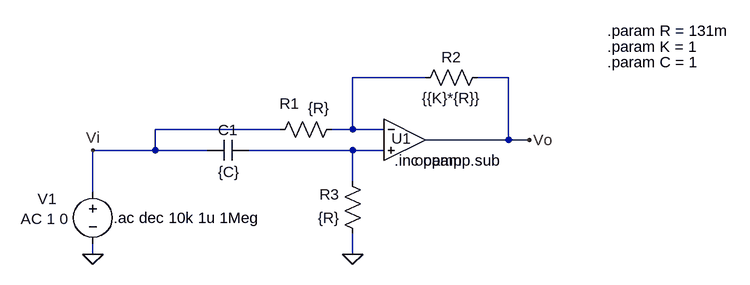
[diagram p0: schematic LatticeActivo.asc]
LatticeActivo.asc, the LTspice schematic file:
Version 4
SHEET 1 880 680
WIRE 288 48 176 48
WIRE 416 48 368 48
WIRE 64 128 -128 128
WIRE 176 128 176 48
WIRE 176 128 144 128
WIRE 224 128 176 128
WIRE 416 144 416 48
WIRE 416 144 288 144
WIRE 448 144 416 144
WIRE -128 160 -128 128
WIRE -128 160 -224 160
WIRE -48 160 -128 160
WIRE 176 160 16 160
WIRE 224 160 176 160
WIRE 176 208 176 160
WIRE -224 224 -224 160
WIRE -224 320 -224 304
WIRE 176 320 176 288
FLAG 176 320 0
FLAG -224 320 0
FLAG 448 144 Vo
FLAG -224 160 Vi
SYMBOL res 160 112 R90
WINDOW 0 -8 81 VBottom 2
WINDOW 3 -33 36 VTop 2
SYMATTR InstName R1
SYMATTR Value {R}
SYMBOL res 384 32 R90
WINDOW 0 0 56 VBottom 2
WINDOW 3 32 56 VTop 2
SYMATTR InstName R2
SYMATTR Value {{K}*{R}}
SYMBOL res 192 304 R180
WINDOW 0 36 76 Left 2
WINDOW 3 36 40 Left 2
SYMATTR InstName R3
SYMATTR Value {R}
SYMBOL cap 16 144 R90
WINDOW 0 0 32 VBottom 2
WINDOW 3 34 30 VTop 2
SYMATTR InstName C1
SYMATTR Value {C}
SYMBOL voltage -224 208 R0
WINDOW 0 -85 27 Left 2
WINDOW 123 -111 58 Left 2
WINDOW 39 0 0 Left 0
SYMATTR InstName V1
SYMATTR Value ""
SYMATTR Value2 AC 1 0
SYMBOL OpAmps\\opamp 256 80 R0
WINDOW 0 -20 62 Left 2
SYMATTR InstName U1
TEXT 240 176 Left 2 !.inc opamp.sub
TEXT 568 -24 Left 2 !.param R = 131m
TEXT 568 0 Left 2 !.param K = 1
TEXT 568 24 Left 2 !.param C = 1
TEXT -192 264 Left 2 !.ac dec 10k 1u 1Meg

The netlist it stands for:
* LatticeActivo.asc
R1 N001 Vi {R}
R2 Vo N001 {{K}*{R}}
R3 0 N002 {R}
C1 N002 Vi {C}
V1 Vi 0 AC 1 0
XU1 N001 N002 Vo opamp Aol=100K GBW=10Meg  ; pins invin noninvin out
.inc opamp.sub
.param R = 131m
.param K = 1
.param C = 1
.ac dec 10k 1u 1Meg
.backanno
.end